# Altium schematic sheet MASTER.SchDoc
size A4; Author: CTHM; Revision: V1R0; SheetNumber: 1; SheetTotal: 3
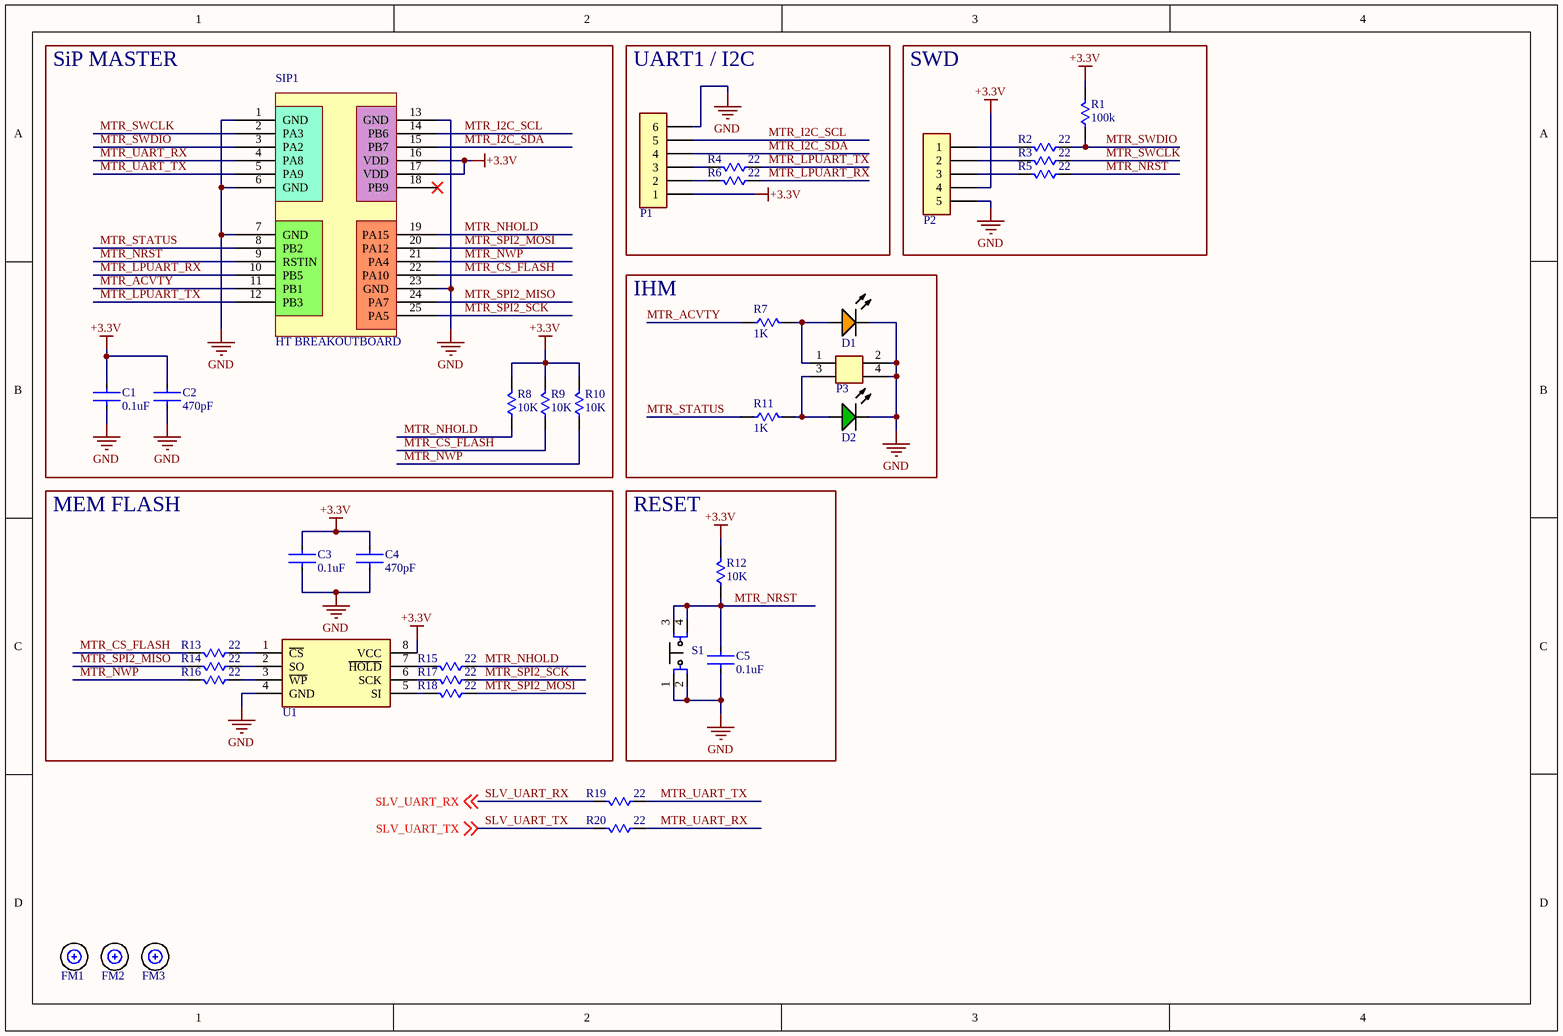
[diagram p0: MASTER.SchDoc]

## Parts
C1  0.1uF  [0805-CAP]
C2  470pF  [0805-CAP]
C3  0.1uF  [0805-CAP]
C4  470pF  [0805-CAP]
C5  0.1uF  [0805-CAP]
D1  ORANGE  [0805-LED-ORANGE]  (value not drawn)
D2  GREEN  [0805-LED-GREEN]  (value not drawn)
FM1  FIDUCIAIS - SMD - POINT  [FIDUCIAL  1mm SMD]  (value not drawn)
FM2  FIDUCIAIS - SMD - POINT  [FIDUCIAL  1mm SMD]  (value not drawn)
FM3  FIDUCIAIS - SMD - POINT  [FIDUCIAL  1mm SMD]  (value not drawn)
P1  75915-306LF  [HEADER_6P_PVF - 75915-306LF]  (value not drawn)
P2  Header 6  [_HEADER_5P_PVF]  (value not drawn)
P3  _HEADER_2X2_PVM_2.54MM  [67997-404HLF]  (value not drawn)
R1  100k  [0805-RES]
R2  22  [0805-RES]
R3  22  [0805-RES]
R4  22  [0805-RES]
R5  22  [0805-RES]
R6  22  [0805-RES]
R7  1K  [0805-RES]
R8  10K  [0805-RES]
R9  10K  [0805-RES]
R10  10K  [0805-RES]
R11  1K  [0805-RES]
R12  10K  [0805-RES]
R13  22  [0805-RES]
R14  22  [0805-RES]
R15  22  [0805-RES]
R16  22  [0805-RES]
R17  22  [0805-RES]
R18  22  [0805-RES]
R19  22  [0805-RES]
R20  22  [0805-RES]
S1  EVQ-P7A01P  [EVQP7A]  (value not drawn)
SIP1  HT BREAKOUTBOARD  [HT BREAKOUTBOARD PINS]
U1  W25Q80DVSNIG  [SOIC-8]  (value not drawn)

## Blocks framed on the sheet
SiP MASTER: C1 C2 R8-R10 SIP1
UART1 / I2C: P1 R4 R6
SWD: P2 R1-R3 R5
IHM: D1 D2 P3 R7 R11
MEM FLASH: C3 C4 R13-R18 U1
RESET: C5 R12 S1

## Nets
+3.3V: C1.1 C2.1 C3.1 C4.1 P1.1 P2.4 R1.2 R8.2 R9.2 R10.2 R12.2 SIP1.16(VDD) SIP1.17(VDD) U1.8(VCC)
GND: C1.2 C2.2 C3.2 C4.2 C5.2 D1.2(K) D2.2(K) P1.6 P2.5 P3.2 P3.4 S1.1 S1.2 SIP1.1(GND) SIP1.6(GND) SIP1.7(GND) SIP1.13(GND) SIP1.23(GND) U1.4(GND)
MTR_ACVTY: R7.1 SIP1.11(PB1)
MTR_CS_FLASH: R9.1 R13.2 SIP1.22(PA10)
MTR_I2C_SCL: P1.5 SIP1.14(PB6)
MTR_I2C_SDA: P1.4 SIP1.15(PB7)
MTR_LPUART_RX: R6.1 SIP1.10(PB5)
MTR_LPUART_TX: R4.1 SIP1.12(PB3)
MTR_NHOLD: R8.1 R15.1 SIP1.19(PA15)
MTR_NRST: C5.1 R5.1 R12.1 S1.3 S1.4 SIP1.9(RSTIN)
MTR_NWP: R10.1 R16.2 SIP1.21(PA4)
MTR_SPI2_MISO: R14.2 SIP1.24(PA7)
MTR_SPI2_MOSI: R18.1 SIP1.20(PA12)
MTR_SPI2_SCK: R17.1 SIP1.25(PA5)
MTR_STATUS: R11.1 SIP1.8(PB2)
MTR_SWCLK: R3.1 SIP1.2(PA3)
MTR_SWDIO: R1.1 R2.1 SIP1.3(PA2)
MTR_UART_RX: R20.1 SIP1.4(PA8)
MTR_UART_TX: R19.1 SIP1.5(PA9)
SLV_UART_RX: R19.2 ; off-sheet SLV_UART_RX
SLV_UART_TX: R20.2 ; off-sheet SLV_UART_TX
NetD1_1: D1.1(A) P3.1 R7.2
NetD2_1: D2.1(A) P3.3 R11.2
NetP1_2: P1.2 R6.2
NetP1_3: P1.3 R4.2
NetP2_1: P2.1 R2.2
NetP2_2: P2.2 R3.2
NetP2_3: P2.3 R5.2
NetR13_1: R13.1 U1.1(~{CS})
NetR14_1: R14.1 U1.2(SO)
NetR15_2: R15.2 U1.7(~{HOLD})
NetR16_1: R16.1 U1.3(~{WP})
NetR17_2: R17.2 U1.6(SCK)
NetR18_2: R18.2 U1.5(SI)

Not connected (* = marked no-connect by the designer): FM1 1; FM2 1; FM3 1; SIP1 18(PB9)*

## Notes on the sheet
- Title:
- Author:
- Sheet:
- Date:
- Revision:
- /

## Library data of the parts
C1 C3 C5 = AC0805KRX7R7BB104: CAP CER SMD 0805, 0.1uF / 16V, ±10%; Manufacturer: Yageo; Value: 100nF; Supplier 1: Mouser; Manufacturer Part Number: AC0805KRX7R7BB104; RoHS: Yes; Category: Ceramic Capacitors; Stock 1: 118257; Pricing 1: 1=0,19, 10=0,079, 50=0,079, 100=0,046, 1000=0,041, 10000=0,028 (USD); Case/Package: 0805; Case Code (Imperial): 0805; Case Code (Metric): 2012; Min Operating Temperature: -55°C; Max Operating Temperature: 125°C; Tolerance: 10%; Voltage Rating: 16V; Packaging: Cut Tape; Series: AC; Ratings: AEC-Q200; RoHS Compliant: Yes; ComponentLink1URL: http://www.yageo.com/NewPortal/_en/search/productDocs.jsp?YageoPartNumber=AC0805KRX7R7BB104&src-supplier=Digi-Key; ComponentLink1Description: http://www.yageo.com/NewPortal/_en/search/productDocs.jsp?YageoPartNumber=AC0805KRX7R7BB104&src-supplier=Digi-Key; Supplier Part Number 1: 603-AC805KRX7R7BB104; Mounting Technology: Surface Mount; Supplier 2: Digi-Key; Supplier 3: Digi-Key; Supplier Part Number 2: 311-3162-1-ND; Supplier Part Number 3: 311-3162-6-ND
C2 C4 = 885012007086: CAP CER SMD 0805, 470pF / 100V, ±5% C0G/NP0; Manufacturer: Wurth Electronics; Supplier 1: Mouser; Manufacturer Part Number: 885012007086; RoHS: No; Category: Ceramic Capacitors; Stock 1: 9461; Pricing 1: 1=0,1, 10=0,08, 50=0,08, 100=0,072, 1000=0,064, 10000=0,054 (USD); Case/Package: 0805; Case Code (Metric): 2012; Case Code (Imperial): 0805; Min Operating Temperature: -55°C; Max Operating Temperature: 125°C; Packaging: Cut Tape; Voltage Rating: 100V; Tolerance: 5%; ComponentLink1URL: https://katalog.we-online.de/pbs/datasheet/885012007086.pdf?src-supplier=Digi-Key; ComponentLink1Description: https://katalog.we-online.de/pbs/datasheet/885012007086.pdf?src-supplier=Digi-Key; Supplier Part Number 1: 710-885012007086; Mounting Technology: Surface Mount; Value: 470pF; Series: WCAP-CSGP; ComponentLink6URL: https://katalog.we-online.de/pbs/datasheet/885012007086.pdf?src-supplier=Digi-Key; ComponentLink6Description: https://katalog.we-online.de/pbs/datasheet/885012007086.pdf?src-supplier=Digi-Key; Supplier 2: Digi-Key; Supplier 3: Digi-Key; Supplier Part Number 2: 732-12213-1-ND; Supplier Part Number 3: 732-12213-6-ND
D1 = LTST-C170AKT: LED ORANGE, SMD 0805, 2.1V/30mA; Manufacturer: Vishay Lite-On; Lens Color: Colorless; Number of LEDs: 1; Reverse Voltage: 5V; Viewing Angle: 130°; Lens Style: Diffused,Colorless,Rectangular,Clear; Luminous Intensity: 2mcd; Forward Voltage: 2.1V; Dominant Wavelength: 602nm; Test Current: 10mA; Lens Transparency: Clear; Wavelength: 610nm; Forward Current: 30mA; Max Power Dissipation: 100mW; Supplier 1: Mouser; Manufacturer Part Number: LTST-C170AKT; RoHS: Yes; Category: LEDs; Stock 1: 1201; Pricing 1: 1=0,2162, 10=0,1414, 25=0,1404, 100=0,0749, 250=0,0738, 500=0,0682, 1000=0,0546 (USD); Case/Package: 0805; Color: Orange; Case Code (Metric): 2012; Case Code (Imperial): 0805; Min Operating Temperature: -55°C; Max Operating Temperature: 85°C; Package Quantity: 1; Packaging: Tape and Reel; Series: CHIPLED 0805; Illumination Color: Orange; Number of Elements: 1; Power Dissipation: 100mW; Length: 2mm; Width: 1.25mm; Height: 1.1mm; Depth: 1.25mm; Radiation Hardening: No; Lead Free: Lead Free; RoHS Compliant: Yes; ComponentLink1URL: https://datasheet.ciiva.com/11773/0900766b80dc0275-11773962.pdf?src-supplier=Rs; ComponentLink1Description: https://datasheet.ciiva.com/11773/0900766b80dc0275-11773962.pdf?src-supplier=Rs; ComponentLink2URL: https://datasheet.ciiva.com/16388/lite-on20ltst-c170akt-16388570.pdf?src-supplier=Future+Electronics; ComponentLink2Description: https://datasheet.ciiva.com/16388/lite-on20ltst-c170akt-16388570.pdf?src-supplier=Future+Electronics; ComponentLink3URL: https://datasheet.ciiva.com/19466/1996129-19466129.pdf?src-supplier=Jameco; ComponentLink3Description: https://datasheet.ciiva.com/19466/1996129-19466129.pdf?src-supplier=Jameco; ComponentLink4URL: https://datasheet.ciiva.com/12400/lite-on-ltst-c170akt-187687-12400757.pdf?src-supplier=Mouser; ComponentLink4Description: https://datasheet.ciiva.com/12400/lite-on-ltst-c170akt-187687-12400757.pdf?src-supplier=Mouser; ComponentLink5URL: https://datasheet.ciiva.com/2110/ltst-c170akt-2110108.pdf?src-supplier=Digi-Key; ComponentLink5Description: https://datasheet.ciiva.com/2110/ltst-c170akt-2110108.pdf?src-supplier=Digi-Key; ComponentLink6URL: https://datasheet.ciiva.com/15117/getdatasheetpartid-147503-15117857.pdf?src-supplier=Verical; ComponentLink6Description: https://datasheet.ciiva.com/15117/getdatasheetpartid-147503-15117857.pdf?src-supplier=Verical; ComponentLink7URL: https://datasheet.ciiva.com/2110/ltst-c170akt-2110109.pdf?src-supplier=Digi-Key; ComponentLink7Description: https://datasheet.ciiva.com/2110/ltst-c170akt-2110109.pdf?src-supplier=Digi-Key; ComponentLink8URL: https://datasheet.ciiva.com/2110/ltst-c170akt-2110110.pdf?src-supplier=Digi-Key; ComponentLink8Description: https://datasheet.ciiva.com/2110/ltst-c170akt-2110110.pdf?src-supplier=Digi-Key; Supplier Part Number 1: 859-LTST-C170AKT; Mounting Technology: Surface Mount; Pins: 2; Supplier 2: Digi-Key; Supplier Part Number 2: 160-1177-1-ND; Supplier 3: Digi-Key; Supplier Part Number 3: 160-1177-6-ND
D2 = LTST-C170GKT: LED GREEN, SMD 0805, 2.1V/30mA; Manufacturer: Vishay Lite-On; Lens Color: Colorless; Luminous Intensity: 6mcd; Forward Current: 30mA; Viewing Angle: 130°; Forward Voltage: 2.1V; Lens Style: Flat,Diffused,Colorless,Rectangular; Power Rating: 100mW; Lens Transparency: Clear; Test Current: 10mA; Dominant Wavelength: 569nm; Number of Elements: 1; Wavelength: 565nm; Reverse Voltage: 5V; Lens Size: 1.25mm; Supplier 1: Mouser; Manufacturer Part Number: LTST-C170GKT; RoHS: Yes; Category: LEDs; Stock 1: 34600; Pricing 1: 250=0,062, 500=0,055, 1250=0,043, 2500=0,041 (GBP); Case/Package: 0805; Color: Green; Case Code (Metric): 2012; Case Code (Imperial): 0805; Min Operating Temperature: -55°C; Max Operating Temperature: 85°C; Packaging: Tape and Reel; Package Quantity: 3000; Illumination Color: Green; Power Dissipation: 100mW; Number of LEDs: 1; Series: -; Length: 2mm; Width: 1.25mm; Height: 1.1mm; Depth: 1.25mm; Radiation Hardening: No; Lead Free: Lead Free; RoHS Compliant: Yes; ComponentLink1URL: https://datasheet.ciiva.com/11773/0900766b80dc0278-11773630.pdf?src-supplier=Rs; ComponentLink1Description: https://datasheet.ciiva.com/11773/0900766b80dc0278-11773630.pdf?src-supplier=Rs; ComponentLink2URL: https://datasheet.ciiva.com/25772/ltst-c170gkt-25772881.pdf?src-supplier=Allied+Electronics; ComponentLink2Description: https://datasheet.ciiva.com/25772/ltst-c170gkt-25772881.pdf?src-supplier=Allied+Electronics; ComponentLink3URL: https://datasheet.ciiva.com/2110/ltst-c170gkt-2110128.pdf?src-supplier=Digi-Key; ComponentLink3Description: https://datasheet.ciiva.com/2110/ltst-c170gkt-2110128.pdf?src-supplier=Digi-Key; ComponentLink4URL: https://datasheet.ciiva.com/12400/lite-on-ltst-c170gkt-187191-12400783.pdf?src-supplier=Mouser; ComponentLink4Description: https://datasheet.ciiva.com/12400/lite-on-ltst-c170gkt-187191-12400783.pdf?src-supplier=Mouser; ComponentLink5URL: https://datasheet.ciiva.com/15117/getdatasheetpartid-142079-15117738.pdf?src-supplier=Verical; ComponentLink5Description: https://datasheet.ciiva.com/15117/getdatasheetpartid-142079-15117738.pdf?src-supplier=Verical; ComponentLink6URL: https://datasheet.ciiva.com/16387/ltst-c170gkt-16387357.pdf?src-supplier=Future+Electronics; ComponentLink6Description: https://datasheet.ciiva.com/16387/ltst-c170gkt-16387357.pdf?src-supplier=Future+Electronics; Supplier Part Number 1: 859-LTST-C170GKT; Mounting Technology: Surface Mount; Pins: 2; Voltage: 5V; Supplier 2: Digi-Key; Supplier Part Number 2: 160-1179-1-ND; Supplier 3: Digi-Key; Supplier Part Number 3: 160-1179-6-ND
P1 = 75915-306LF: Dubox®, Board To Board Connector, Receptacle, Vertical, Through Hole, Single Row, Top Entry, 6 Positions, 2.54mm...; Manufacturer: Amphenol ICC / FCI; Number of Positions: 6; Voltage Rating: 1kV; Current Rating: 3A; Contact Resistance: 20mR; Pitch: 2.54mm; Stack Height: 8.5mm; Manufacturer Part Number: 75915-306LF; RoHS: No; Category: Connectors; Stock 1: 10427; Pricing 1: 1=0,8242, 10=0,6975, 25=0,6703, 50=0,6435, 100=0,5765, 250=0,4365 (USD); Mounting Technology: Through Hole; Contact Plating: Gold; Color: Blue; Contact Material: Bronze; Housing Material: Thermoplastic; Housing Color: Blue; Min Operating Temperature: -65°C; Max Operating Temperature: 125°C; Connector Type: Receptacle; Series: DUBOX™, MezzSelect™, Basics+; Packaging: Rail/Tube; Number of Rows: 1; Termination: Solder; Package Quantity: 38; Number of Contacts: 6; Gender: Receptacle; Orientation: Straight; Max Voltage Rating (AC): 1kV; Length: 15.16mm; Depth: 2.5mm; Radiation Hardening: No; Reach SVHC Compliant: No; ComponentLink1URL: http://uk.rs-online.com/webdocs/1450/0900766b81450f78.pdf?src-supplier=Rs; ComponentLink1Description: http://uk.rs-online.com/webdocs/1450/0900766b81450f78.pdf?src-supplier=Rs; ComponentLink2URL: https://www.alliedelec.com/m/d/3fdd05ac84d362d84c92a466b6b2a112.pdf?src-supplier=Allied+Electronics; ComponentLink2Description: https://www.alliedelec.com/m/d/3fdd05ac84d362d84c92a466b6b2a112.pdf?src-supplier=Allied+Electronics; ComponentLink3URL: https://datasheet.octopart.com/75915-306LF-Amphenol-Communications-Solutions-datasheet-8496762.pdf?src-supplier=Newark; ComponentLink3Description: https://datasheet.octopart.com/75915-306LF-Amphenol-Communications-Solutions-datasheet-8496762.pdf?src-supplier=Newark; ComponentLink4URL: http://portal.fciconnect.com/Comergent/fci/drawing/75915.pdf?src-supplier=Avnet; ComponentLink4Description: http://portal.fciconnect.com/Comergent/fci/drawing/75915.pdf?src-supplier=Avnet; ComponentLink5URL: https://cdn.amphenol-icc.com/media/wysiwyg/files/drawing/75915.pdf?src-supplier=Digi-Key; ComponentLink5Description: https://cdn.amphenol-icc.com/media/wysiwyg/files/drawing/75915.pdf?src-supplier=Digi-Key; ComponentLink6URL: http://www.mouser.com/ds/2/154/75915-68319.pdf?src-supplier=Mouser; ComponentLink6Description: http://www.mouser.com/ds/2/154/75915-68319.pdf?src-supplier=Mouser; ComponentLink7URL: http://components.arrow.com/part/dataview/41915849S8311523N8314?src-supplier=Arrow+Electronics; ComponentLink7Description: http://components.arrow.com/part/dataview/41915849S8311523N8314?src-supplier=Arrow+Electronics; ComponentLink8URL: http://portal.fciconnect.com/Comergent/fci/drawing/75915.pdf?src-supplier=Element14; ComponentLink8Description: http://portal.fciconnect.com/Comergent/fci/drawing/75915.pdf?src-supplier=Element14; ComponentLink9URL: https://datasheet.octopart.com/75915-306LF-Amphenol-datasheet-94059536.pdf?src-supplier=Element14; ComponentLink9Description: https://datasheet.octopart.com/75915-306LF-Amphenol-datasheet-94059536.pdf?src-supplier=Element14; ComponentLink10URL: https://datasheet.octopart.com/75915-306LF-Amphenol-Communications-Solutions-datasheet-168215130.pdf?src-supplier=TME; ComponentLink10Description: https://datasheet.octopart.com/75915-306LF-Amphenol-Communications-Solutions-datasheet-168215130.pdf?src-supplier=TME; Supplier 1: Mouser; Supplier Part Number 1: 649-75915-306LF; Supplier 2: Digi-Key; Supplier Part Number 2: 609-3558-ND
P2 = 75915-305LF: Dubox®, Board To Board Connector, Receptacle, Vertical, Through Hole, Single Row, Top Entry, 5 Positions, 2.54mm...; Manufacturer: Amphenol ICC / FCI; Number of Positions: 5; Gender: Female; Max Voltage Rating (AC): 1kV; Contact Resistance: 20mR; Pitch: 2.54mm; Supplier 1: Mouser; Supplier Part Number 1: 649-75915-305LF; Manufacturer Part Number: 75915-305LF; RoHS: Yes; Category: Connectors; Stock 1: 1208; Pricing 1: 1=0,9623, 10=0,7633, 25=0,7318, 50=0,6655, 100=0,6312, 500=0,4183 (USD); Mounting Technology: Through Hole; Contact Plating: Gold; Color: Blue; Contact Material: Bronze; Housing Material: Thermoplastic; Housing Color: Blue; Min Operating Temperature: -65°C; Max Operating Temperature: 125°C; Connector Type: Receptacle; Series: DUBOX™, MezzSelect™, Basics+; Packaging: Rail/Tube; Number of Rows: 1; Termination: Solder; Package Quantity: 46; Number of Contacts: 5; Orientation: Straight; Length: 12.62mm; Depth: 2.5mm; Radiation Hardening: No; ComponentLink1URL: https://datasheet.ciiva.com/10148/75915-10148925.pdf?src-supplier=Avnet; ComponentLink1Description: https://datasheet.ciiva.com/10148/75915-10148925.pdf?src-supplier=Avnet; ComponentLink2URL: https://datasheet.ciiva.com/411/75915-411935.pdf?src-supplier=Digi-Key; ComponentLink2Description: https://datasheet.ciiva.com/411/75915-411935.pdf?src-supplier=Digi-Key; Supplier 2: Digi-Key; Supplier Part Number 2: 609-5979-ND; Lead Free: Lead Free
P3 = _HEADER_2X2_PVM_2.54MM: HEADER 2X3, PTH-2.54MM, VERT, MALE
R1 = ERJ-6GEYJ104V: RES SMD 0805, 100K OHM 5% 1/8W; Manufacturer: Panasonic; Resistance: 100kR; Power Rating: 125mW; Voltage Rating: 150V; Temperature Coefficient: 200ppm/°C; Supplier 1: Mouser; Manufacturer Part Number: ERJ-6GEYJ104V; Stock 1: 1160981; Pricing 1: 1 = 0,10000, 10 = 0,06100, 100 = 0,02490, 1000 = 0,01120, 2500 = 0,00972 (USD); RoHS: Yes; Mount: Surface Mount; Case/Package: 0805; Weight: 0.000194oz; Case Code (Metric): 2012; Case Code (Imperial): 0805; Contact Plating: Tin; Min Operating Temperature: -55°C; Max Operating Temperature: 155°C; Tolerance: 5%; Packaging: Tape and Reel; Composition: Thick Film; Package Quantity: 5000; Number of Terminations: 2; Termination: SMD/SMT; Max Power Dissipation: 125mW; Features: Automotive AEC-Q200; Military Standard: Not; Voltage Rating (DC): 150V; Length: 2mm; Height: 0.6mm; Width: 0.049inch; Depth: 1.25mm; Radiation Hardening: No; Lead Free: Lead Free; REACH SVHC: No SVHC; ComponentLink1URL: https://datasheet.ciiva.com/11821/0900766b80f806dd-11821506.pdf?src-supplier=RSComponents; ComponentLink1Description: https://datasheet.ciiva.com/11821/0900766b80f806dd-11821506.pdf?src-supplier=RSComponents; ComponentLink2URL: https://datasheet.ciiva.com/34303/2007290-34303759.pdf?src-supplier=Jameco; ComponentLink2Description: https://datasheet.ciiva.com/34303/2007290-34303759.pdf?src-supplier=Jameco; ComponentLink3URL: https://datasheet.ciiva.com/16771/70255313-16771462.pdf?src-supplier=Allied+Electronics; ComponentLink3Description: https://datasheet.ciiva.com/16771/70255313-16771462.pdf?src-supplier=Allied+Electronics; ComponentLink4URL: https://datasheet.ciiva.com/43460/1500035-43460136.pdf?src-supplier=Farnell; ComponentLink4Description: https://datasheet.ciiva.com/43460/1500035-43460136.pdf?src-supplier=Farnell; ComponentLink5URL: https://datasheet.ciiva.com/22758/1500035-22758234.pdf?src-supplier=Farnell; ComponentLink5Description: https://datasheet.ciiva.com/22758/1500035-22758234.pdf?src-supplier=Farnell; ComponentLink6URL: https://datasheet.ciiva.com/17208/aoa0000ce1-17208156.pdf?src-supplier=Avnet+Europe; ComponentLink6Description: https://datasheet.ciiva.com/17208/aoa0000ce1-17208156.pdf?src-supplier=Avnet+Europe; ComponentLink7URL: https://datasheet.ciiva.com/30137/4aoa0000ce1-30137389.pdf?src-supplier=Onlinecomponents.com; ComponentLink7Description: https://datasheet.ciiva.com/30137/4aoa0000ce1-30137389.pdf?src-supplier=Onlinecomponents.com; ComponentLink8URL: https://datasheet.ciiva.com/9117/aoa0000ce1-9117374.pdf?src-supplier=Avnet; ComponentLink8Description: https://datasheet.ciiva.com/9117/aoa0000ce1-9117374.pdf?src-supplier=Avnet; ComponentLink9URL: https://datasheet.ciiva.com/46380/1500035-46380511.pdf?src-supplier=Element14; ComponentLink9Description: https://datasheet.ciiva.com/46380/1500035-46380511.pdf?src-supplier=Element14; Supplier Part Number 1: 667-ERJ-6GEYJ104V; Supplier 2: Digi-Key; Supplier Part Number 2: P100KACT-ND; Supplier 3: Digi-Key; Supplier Part Number 3: P100KADKR-ND
R2 = ERJ-P06J220V: RES SMD 0805, 22 OHM 5% 1/4W; Manufacturer: Panasonic; Value: 22R; Power Rating: 500mW; Voltage Rating: 150V; Temperature Coefficient: 300ppm/°C; Supplier 1: Mouser; Manufacturer Part Number: ERJ-P06J220V; RoHS: Yes; Category: Chip SMD Resistors; Stock 1: 62638; Pricing 1: 1=0,11, 10=0,056, 50=0,056, 100=0,025, 1000=0,018, 5000=0,014, 10000=0,013, 25000=0,011, 50000=0,01 (USD); Case/Package: 0805; Case Code (Metric): 2012; Case Code (Imperial): 0805; Contact Plating: Tin; Min Operating Temperature: -55°C; Max Operating Temperature: 155°C; Tolerance: 5%; Package Quantity: 1; Packaging: Tape and Reel; Number of Terminations: 2; Max Power Dissipation: 500mW; Features: Automotive AEC-Q200; Series: ERJ; Length: 0.079inch; Width: 1.2mm; Height: 0.028inch; RoHS Compliant: Yes; ComponentLink1URL: https://datasheet.ciiva.com/9191/aoa0000ce4-9191918.pdf?src-supplier=Avnet; ComponentLink1Description: https://datasheet.ciiva.com/9191/aoa0000ce4-9191918.pdf?src-supplier=Avnet; ComponentLink2URL: https://datasheet.ciiva.com/30188/aoa0000ce4-30188085.pdf?src-supplier=Onlinecomponents.com; ComponentLink2Description: https://datasheet.ciiva.com/30188/aoa0000ce4-30188085.pdf?src-supplier=Onlinecomponents.com; Supplier Part Number 1: 667-ERJ-P06J220V; Mounting Technology: Surface Mount; Voltage Rating (DC): 150V; Lead Free: Lead Free; Supplier 2: Digi-Key; Stock 2: 967; Pricing 2: 1=0,11, 10=0,095, 50=0,051, 100=0,0364, 500=0,02254, 1000=0,016 (USD); Supplier 3: Digi-Key; Stock 3: 967; Pricing 3: 1=0,11, 10=0,095, 50=0,051, 100=0,0364, 500=0,02254, 1000=0,016 (USD); Supplier Part Number 2: P22ADCT-ND; Supplier Part Number 3: P22ADDKR-ND
R3-R6 R13-R20 = ERJ-P06J220V: RES SMD 0805, 22 OHM 5% 1/4W; Manufacturer: Panasonic; Power Rating: 500mW; Temperature Coefficient: 300ppm/°C; Value: 22R; Voltage Rating: 150V; Supplier 1: Mouser; Manufacturer Part Number: ERJ-P06J220V; Stock 1: 62638; Pricing 1: 1=0,11, 10=0,056, 50=0,056, 100=0,025, 1000=0,018, 5000=0,014, 10000=0,013, 25000=0,011, 50000=0,01 (USD); Case/Package: 0805; Contact Plating: Tin; Min Operating Temperature: -55°C; Max Operating Temperature: 155°C; Tolerance: 5%; Length: 0.079inch; Supplier Part Number 1: 667-ERJ-P06J220V; RoHS: Yes; Category: Chip SMD Resistors; Case Code (Metric): 2012; Case Code (Imperial): 0805; Package Quantity: 1; Packaging: Tape and Reel; Number of Terminations: 2; Max Power Dissipation: 500mW; Features: Automotive AEC-Q200; Series: ERJ; Width: 1.2mm; Height: 0.028inch; RoHS Compliant: Yes; ComponentLink1URL: https://datasheet.ciiva.com/9191/aoa0000ce4-9191918.pdf?src-supplier=Avnet; ComponentLink1Description: https://datasheet.ciiva.com/9191/aoa0000ce4-9191918.pdf?src-supplier=Avnet; ComponentLink2URL: https://datasheet.ciiva.com/30188/aoa0000ce4-30188085.pdf?src-supplier=Onlinecomponents.com; ComponentLink2Description: https://datasheet.ciiva.com/30188/aoa0000ce4-30188085.pdf?src-supplier=Onlinecomponents.com; Mounting Technology: Surface Mount; Voltage Rating (DC): 150V; Lead Free: Lead Free; Supplier 2: Digi-Key; Stock 2: 967; Pricing 2: 1=0,11, 10=0,095, 50=0,051, 100=0,0364, 500=0,02254, 1000=0,016 (USD); Supplier 3: Digi-Key; Stock 3: 967; Pricing 3: 1=0,11, 10=0,095, 50=0,051, 100=0,0364, 500=0,02254, 1000=0,016 (USD); Supplier Part Number 2: P22ADCT-ND; Supplier Part Number 3: P22ADDKR-ND
R7 R11 = RNCP0805FTD1K00: Res Thin Film 0805 1K Ohm 1% 0.25W(1/4W) ±100ppm/C Sulfur Resistant Pad SMD T/R; Manufacturer: Stackpole Electronics; Temperature Coefficient: 100ppm/°C; Value: 1kR; Power Rating: 250mW; Supplier 1: Mouser; Manufacturer Part Number: RNCP0805FTD1K00; RoHS: Yes; Category: Chip SMD Resistors; Stock 1: 70653; Pricing 1: 1=0,1, 10=0,069, 50=0,069, 100=0,029, 1000=0,013, 10000=0,007 (USD); Packaging: Cut Tape; Features: Moisture Resistant,Anti-Sulfur; ComponentLink1URL: http://www.seielect.com/Catalog/SEI-rncp.pdf?src-supplier=Future+Electronics; ComponentLink1Description: http://www.seielect.com/Catalog/SEI-rncp.pdf?src-supplier=Future+Electronics; Supplier Part Number 1: 708-RNCP0805FTD1K00; Tolerance: 1%; Mounting Technology: Surface Mount; Case/Package: 0805; Case Code (Metric): 2012; Case Code (Imperial): 0805; Min Operating Temperature: -55°C; Max Operating Temperature: 155°C; Number of Terminations: 2; Max Power Dissipation: 250mW; Series: RNCP; Length: 0.079inch; Width: 0.049inch; Height: 0.024inch; Lead Free: Lead Free; RoHS Compliant: Yes; ComponentLink2URL: https://www.seielect.com/catalog/SEI-Packaging.pdf?src-supplier=Digi-Key; ComponentLink2Description: https://www.seielect.com/catalog/SEI-Packaging.pdf?src-supplier=Digi-Key; ComponentLink3URL: https://www.seielect.com/Catalog/SEI-rncp.pdf?src-supplier=Digi-Key; ComponentLink3Description: https://www.seielect.com/Catalog/SEI-rncp.pdf?src-supplier=Digi-Key; Supplier 2: Digi-Key; Supplier 3: Digi-Key; Supplier Part Number 2: RNCP0805FTD1K00CT-ND; Supplier Part Number 3: RNCP0805FTD1K00DKR-ND
R8-R10 R12 = RNCP0805FTD10K0: Res Thin Film 0805 10K Ohm 1% 1/4W ±100ppm/°C Molded SMD Paper T/R; Manufacturer: Stackpole Electronics; Value: 10kR; Max Power Dissipation: 250mW; Supplier 1: Mouser; Manufacturer Part Number: RNCP0805FTD10K0; Stock 1: 197654; Pricing 1: 1=0,1, 10=0,069, 50=0,069, 100=0,029, 1000=0,013, 10000=0,007 (USD); RoHS: Yes; Tolerance: 1%; Packaging: Cut Tape; Temperature Coefficient: 100ppm/°C; ComponentLink1URL: https://datasheet.octopart.com/RNCP0805FTD10K0-Stackpole-Electronics-datasheet-33021030.pdf?src-supplier=Future+Electronics; ComponentLink1Description: https://datasheet.octopart.com/RNCP0805FTD10K0-Stackpole-Electronics-datasheet-33021030.pdf?src-supplier=Future+Electronics; Supplier Part Number 1: 708-RNCP0805FTD10K0; Category: Chip SMD Resistors; Features: Moisture Resistant,Anti-Sulfur; Mounting Technology: Surface Mount; Case/Package: 0805; Case Code (Metric): 2012; Case Code (Imperial): 0805; Min Operating Temperature: -55°C; Max Operating Temperature: 155°C; Number of Terminations: 2; Series: RNCP; Length: 0.079inch; Width: 0.049inch; Height: 0.024inch; Lead Free: Lead Free; RoHS Compliant: Yes; ComponentLink2URL: https://www.seielect.com/catalog/SEI-Packaging.pdf?src-supplier=Digi-Key; ComponentLink2Description: https://www.seielect.com/catalog/SEI-Packaging.pdf?src-supplier=Digi-Key; Supplier 2: Digi-Key; Supplier Part Number 2: RNCP0805FTD10K0CT-ND; Supplier 3: Digi-Key; Supplier Part Number 3: RNCP0805FTD10K0DKR-ND
S1 = EVQ-P7A01P: Switch Tactile N.O. SPST Rectangular Button Gull Wing 0.05A 12VDC 2.2N SMD Embossed T/R; Manufacturer: Panasonic; Switch Function: Off-Mom; Max Voltage Rating (DC): 12V; Contact Resistance: 500mR; Contact Current Rating: 50mA; Electrical Life: 100000Cycles; Illumination Type: Non-Illuminated; Actuator Length: 0.65mm; Switch Travel: 0.2mm; Actuator Color: Black; Supplier 1: Mouser; Stock 1: 48946; Pricing 1: 1=0,28, 10=0,258, 50=0,258, 100=0,213, 1000=0,169, 10000=0,138 (USD); Min Operating Temperature: -20°C; Max Operating Temperature: 70°C; Throw Configuration: SPST; Operating Force: 2.2N; Packaging: Tape and Reel; Package Quantity: 5000; Orientation: Right Angle; Termination: Gull Wing; Radiation Hardening: No; ComponentLink1URL: https://www3.panasonic.biz/ac/e_download/control/switch/light-touch/catalog/sw_lt_eng_3529s_side.pdf; ComponentLink1Description: https://www3.panasonic.biz/ac/e_download/control/switch/light-touch/catalog/sw_lt_eng_3529s_side.pdf; Supplier Part Number 1: 667-EVQP7A01P; Case/Package: SMD/SMT; Mechanical Life: 100000Cycles; Lead Free: Lead Free; Manufacturer Part Number: EVQ-P7A01P; RoHS: Yes; Category: Tactile Switches; Mounting Technology: Surface Mount; Series: EVQP7; Reach SVHC Compliant: Unknown; ComponentLink2URL: https://datasheet.ciiva.com/30108/atk0000ce20-30108102.pdf?src-supplier=Onlinecomponents.com; ComponentLink2Description: https://datasheet.ciiva.com/30108/atk0000ce20-30108102.pdf?src-supplier=Onlinecomponents.com; Supplier 2: Digi-Key; Supplier 3: Digi-Key; Supplier Part Number 2: P16763CT-ND; Supplier Part Number 3: P16763DKR-ND
SIP1 = HT BREAKOUTBOARD: Pinos Fêmea para encaixe de HT Breakout
U1 = W25Q80DVSNIG: IC FLASH 8MBIT 104MHZ 8SOIC; Manufacturer: Winbond; Memory Format: Non-Volatile,FLASH; Memory Size: 8Mb; Supplier 1: Mouser; RoHS: Yes; Category: Flash; Stock 1: 106019; Pricing 1: 1=0,51, 10=0,5, 25=0,464, 50=0,4616, 100=0,4099, 250=0,40472, 500=0,39858, 1000=0,38794, 5000=0,34874 (USD); Case/Package: SOIC; Min Operating Temperature: -40°C; Max Operating Temperature: 85°C; Packaging: Rail/Tube; Frequency: 104MHz; RoHS Compliant: Yes; ComponentLink1URL: http://www.winbond.com/resource-files/w25q80dv%20dl_revh_10022015.pdf?src-supplier=Digi-Key; ComponentLink1Description: http://www.winbond.com/resource-files/w25q80dv%20dl_revh_10022015.pdf?src-supplier=Digi-Key; Supplier Part Number 1: 454-W25Q80DVSNIG; Manufacturer Part Number: W25Q80DVSNIG; Mounting Technology: Surface Mount; Series: SpiFlash®; Supplier 2: Digi-Key; Supplier Part Number 2: W25Q80DVSNIG-ND